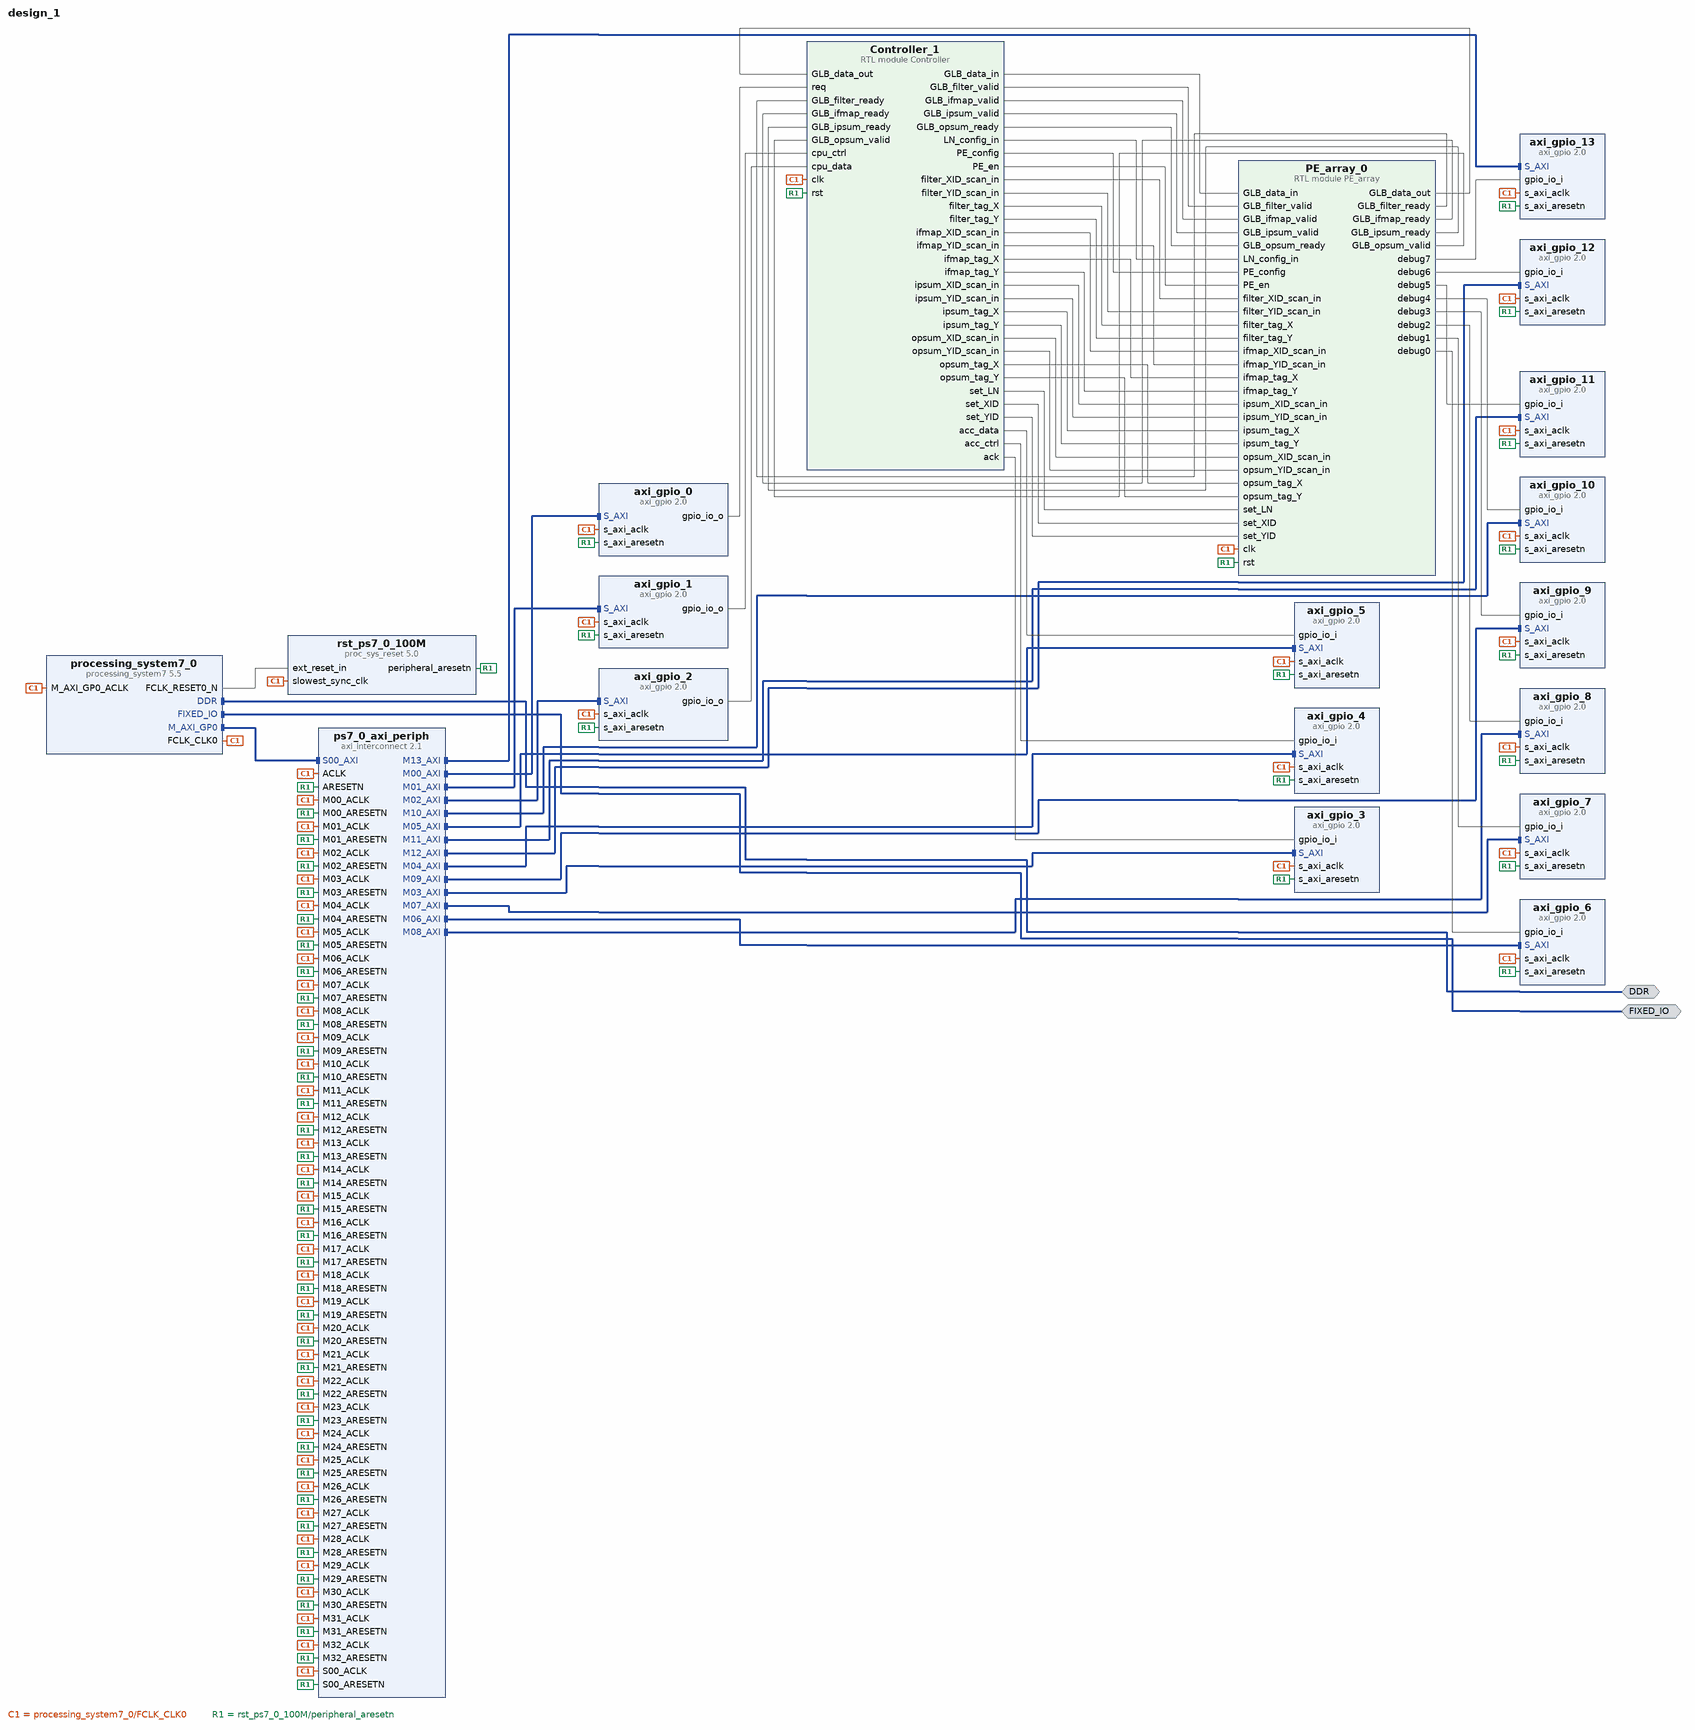
[diagram p0: block diagram of the top level]
# Vivado block design design_1, xc7z020clg400-1, Vivado 2023.2
create_bd_design design_1

create_bd_intf_port -mode Master -vlnv xilinx.com:interface:ddrx_rtl:1.0 DDR
create_bd_intf_port -mode Master -vlnv xilinx.com:display_processing_system7:fixedio_rtl:1.0 FIXED_IO

create_bd_cell -type ip -vlnv xilinx.com:ip:processing_system7:5.5 processing_system7_0
set_property -dict [list \
  CONFIG.PCW_APU_PERIPHERAL_FREQMHZ 650 \
  CONFIG.PCW_CRYSTAL_PERIPHERAL_FREQMHZ 50 \
  CONFIG.PCW_ENET0_ENET0_IO {MIO 16 .. 27} \
  CONFIG.PCW_ENET0_GRP_MDIO_ENABLE 1 \
  CONFIG.PCW_ENET0_GRP_MDIO_IO {MIO 52 .. 53} \
  CONFIG.PCW_ENET0_PERIPHERAL_ENABLE 1 \
  CONFIG.PCW_ENET0_RESET_ENABLE 1 \
  CONFIG.PCW_ENET0_RESET_IO {MIO 9} \
  CONFIG.PCW_ENET_RESET_ENABLE 1 \
  CONFIG.PCW_ENET_RESET_SELECT {Share reset pin} \
  CONFIG.PCW_FPGA0_PERIPHERAL_FREQMHZ 50 \
  CONFIG.PCW_FPGA1_PERIPHERAL_FREQMHZ 50 \
  CONFIG.PCW_GPIO_MIO_GPIO_ENABLE 1 \
  CONFIG.PCW_GPIO_MIO_GPIO_IO MIO \
  CONFIG.PCW_I2C_RESET_ENABLE 1 \
  CONFIG.PCW_M_AXI_GP0_FREQMHZ 10 \
  CONFIG.PCW_PERIPHERAL_BOARD_PRESET part0 \
  CONFIG.PCW_PRESET_BANK1_VOLTAGE {LVCMOS 1.8V} \
  CONFIG.PCW_QSPI_GRP_FBCLK_ENABLE 1 \
  CONFIG.PCW_QSPI_GRP_FBCLK_IO {MIO 8} \
  CONFIG.PCW_QSPI_GRP_SINGLE_SS_ENABLE 1 \
  CONFIG.PCW_QSPI_GRP_SINGLE_SS_IO {MIO 1 .. 6} \
  CONFIG.PCW_QSPI_PERIPHERAL_ENABLE 1 \
  CONFIG.PCW_QSPI_QSPI_IO {MIO 1 .. 6} \
  CONFIG.PCW_SD0_GRP_CD_ENABLE 1 \
  CONFIG.PCW_SD0_GRP_CD_IO {MIO 47} \
  CONFIG.PCW_SD0_GRP_WP_ENABLE 0 \
  CONFIG.PCW_SD0_PERIPHERAL_ENABLE 1 \
  CONFIG.PCW_SD0_SD0_IO {MIO 40 .. 45} \
  CONFIG.PCW_SDIO_PERIPHERAL_FREQMHZ 50 \
  CONFIG.PCW_SINGLE_QSPI_DATA_MODE x4 \
  CONFIG.PCW_UART0_PERIPHERAL_ENABLE 1 \
  CONFIG.PCW_UART0_UART0_IO {MIO 14 .. 15} \
  CONFIG.PCW_UART1_PERIPHERAL_ENABLE 0 \
  CONFIG.PCW_UART_PERIPHERAL_FREQMHZ 100 \
  CONFIG.PCW_UIPARAM_DDR_BUS_WIDTH {16 Bit} \
  CONFIG.PCW_UIPARAM_DDR_FREQ_MHZ 525 \
  CONFIG.PCW_UIPARAM_DDR_PARTNO {MT41J256M16 RE-125} \
  CONFIG.PCW_USB0_PERIPHERAL_ENABLE 1 \
  CONFIG.PCW_USB0_RESET_ENABLE 1 \
  CONFIG.PCW_USB0_RESET_IO {MIO 46} \
  CONFIG.PCW_USB0_USB0_IO {MIO 28 .. 39} \
  CONFIG.PCW_USB_RESET_ENABLE 1 \
  CONFIG.PCW_USB_RESET_SELECT {Share reset pin} \
] [get_bd_cells processing_system7_0]
# 486 more settings of processing_system7_0 are not shown: defaults, MIO pin electricals, DDR timing, and values the tool derives
create_bd_cell -type ip -vlnv xilinx.com:ip:axi_interconnect:2.1 ps7_0_axi_periph
set_property -dict {CONFIG.NUM_MI 33} [get_bd_cells ps7_0_axi_periph]
create_bd_cell -type ip -vlnv xilinx.com:ip:proc_sys_reset:5.0 rst_ps7_0_100M
create_bd_cell -type module -reference Controller Controller_1
create_bd_cell -type ip -vlnv xilinx.com:ip:axi_gpio:2.0 axi_gpio_0
set_property -dict {CONFIG.C_ALL_OUTPUTS 1 CONFIG.C_GPIO_WIDTH 8} [get_bd_cells axi_gpio_0]
create_bd_cell -type ip -vlnv xilinx.com:ip:axi_gpio:2.0 axi_gpio_1
set_property -dict {CONFIG.C_ALL_OUTPUTS 1 CONFIG.C_GPIO_WIDTH 32} [get_bd_cells axi_gpio_1]
create_bd_cell -type ip -vlnv xilinx.com:ip:axi_gpio:2.0 axi_gpio_2
set_property -dict {CONFIG.C_ALL_OUTPUTS 1 CONFIG.C_GPIO_WIDTH 32} [get_bd_cells axi_gpio_2]
create_bd_cell -type ip -vlnv xilinx.com:ip:axi_gpio:2.0 axi_gpio_3
set_property -dict {CONFIG.C_ALL_INPUTS 1} [get_bd_cells axi_gpio_3]
create_bd_cell -type ip -vlnv xilinx.com:ip:axi_gpio:2.0 axi_gpio_4
set_property -dict {CONFIG.C_ALL_INPUTS 1} [get_bd_cells axi_gpio_4]
create_bd_cell -type ip -vlnv xilinx.com:ip:axi_gpio:2.0 axi_gpio_5
set_property -dict {CONFIG.C_ALL_INPUTS 1} [get_bd_cells axi_gpio_5]
create_bd_cell -type ip -vlnv xilinx.com:ip:axi_gpio:2.0 axi_gpio_6
set_property -dict {CONFIG.C_ALL_INPUTS 1} [get_bd_cells axi_gpio_6]
create_bd_cell -type ip -vlnv xilinx.com:ip:axi_gpio:2.0 axi_gpio_7
set_property -dict {CONFIG.C_ALL_INPUTS 1} [get_bd_cells axi_gpio_7]
create_bd_cell -type ip -vlnv xilinx.com:ip:axi_gpio:2.0 axi_gpio_8
set_property -dict {CONFIG.C_ALL_INPUTS 1} [get_bd_cells axi_gpio_8]
create_bd_cell -type ip -vlnv xilinx.com:ip:axi_gpio:2.0 axi_gpio_9
set_property -dict {CONFIG.C_ALL_INPUTS 1} [get_bd_cells axi_gpio_9]
create_bd_cell -type ip -vlnv xilinx.com:ip:axi_gpio:2.0 axi_gpio_10
set_property -dict {CONFIG.C_ALL_INPUTS 1} [get_bd_cells axi_gpio_10]
create_bd_cell -type ip -vlnv xilinx.com:ip:axi_gpio:2.0 axi_gpio_11
set_property -dict {CONFIG.C_ALL_INPUTS 1} [get_bd_cells axi_gpio_11]
create_bd_cell -type ip -vlnv xilinx.com:ip:axi_gpio:2.0 axi_gpio_12
set_property -dict {CONFIG.C_ALL_INPUTS 1} [get_bd_cells axi_gpio_12]
create_bd_cell -type ip -vlnv xilinx.com:ip:axi_gpio:2.0 axi_gpio_13
set_property -dict {CONFIG.C_ALL_INPUTS 1} [get_bd_cells axi_gpio_13]
create_bd_cell -type module -reference PE_array PE_array_0

# ---- connections ----

connect_bd_intf_net [get_bd_intf_ports DDR] [get_bd_intf_pins processing_system7_0/DDR]
connect_bd_intf_net [get_bd_intf_ports FIXED_IO] [get_bd_intf_pins processing_system7_0/FIXED_IO]
connect_bd_intf_net [get_bd_intf_pins processing_system7_0/M_AXI_GP0] [get_bd_intf_pins ps7_0_axi_periph/S00_AXI]
connect_bd_intf_net [get_bd_intf_pins ps7_0_axi_periph/M00_AXI] [get_bd_intf_pins axi_gpio_0/S_AXI]
connect_bd_intf_net [get_bd_intf_pins ps7_0_axi_periph/M01_AXI] [get_bd_intf_pins axi_gpio_1/S_AXI]
connect_bd_intf_net [get_bd_intf_pins ps7_0_axi_periph/M02_AXI] [get_bd_intf_pins axi_gpio_2/S_AXI]
connect_bd_intf_net [get_bd_intf_pins ps7_0_axi_periph/M03_AXI] [get_bd_intf_pins axi_gpio_3/S_AXI]
connect_bd_intf_net [get_bd_intf_pins ps7_0_axi_periph/M04_AXI] [get_bd_intf_pins axi_gpio_4/S_AXI]
connect_bd_intf_net [get_bd_intf_pins ps7_0_axi_periph/M05_AXI] [get_bd_intf_pins axi_gpio_5/S_AXI]
connect_bd_intf_net [get_bd_intf_pins ps7_0_axi_periph/M06_AXI] [get_bd_intf_pins axi_gpio_6/S_AXI]
connect_bd_intf_net [get_bd_intf_pins ps7_0_axi_periph/M07_AXI] [get_bd_intf_pins axi_gpio_7/S_AXI]
connect_bd_intf_net [get_bd_intf_pins ps7_0_axi_periph/M08_AXI] [get_bd_intf_pins axi_gpio_8/S_AXI]
connect_bd_intf_net [get_bd_intf_pins ps7_0_axi_periph/M09_AXI] [get_bd_intf_pins axi_gpio_9/S_AXI]
connect_bd_intf_net [get_bd_intf_pins ps7_0_axi_periph/M10_AXI] [get_bd_intf_pins axi_gpio_10/S_AXI]
connect_bd_intf_net [get_bd_intf_pins ps7_0_axi_periph/M11_AXI] [get_bd_intf_pins axi_gpio_11/S_AXI]
connect_bd_intf_net [get_bd_intf_pins ps7_0_axi_periph/M12_AXI] [get_bd_intf_pins axi_gpio_12/S_AXI]
connect_bd_intf_net [get_bd_intf_pins ps7_0_axi_periph/M13_AXI] [get_bd_intf_pins axi_gpio_13/S_AXI]
connect_bd_net [get_bd_pins Controller_1/GLB_data_in] [get_bd_pins PE_array_0/GLB_data_in]
connect_bd_net [get_bd_pins Controller_1/GLB_filter_valid] [get_bd_pins PE_array_0/GLB_filter_valid]
connect_bd_net [get_bd_pins Controller_1/GLB_ifmap_valid] [get_bd_pins PE_array_0/GLB_ifmap_valid]
connect_bd_net [get_bd_pins Controller_1/GLB_ipsum_valid] [get_bd_pins PE_array_0/GLB_ipsum_valid]
connect_bd_net [get_bd_pins Controller_1/GLB_opsum_ready] [get_bd_pins PE_array_0/GLB_opsum_ready]
connect_bd_net [get_bd_pins Controller_1/LN_config_in] [get_bd_pins PE_array_0/LN_config_in]
connect_bd_net [get_bd_pins Controller_1/PE_config] [get_bd_pins PE_array_0/PE_config]
connect_bd_net [get_bd_pins Controller_1/PE_en] [get_bd_pins PE_array_0/PE_en]
connect_bd_net [get_bd_pins Controller_1/acc_ctrl] [get_bd_pins axi_gpio_4/gpio_io_i]
connect_bd_net [get_bd_pins Controller_1/acc_data] [get_bd_pins axi_gpio_5/gpio_io_i]
connect_bd_net [get_bd_pins Controller_1/ack] [get_bd_pins axi_gpio_3/gpio_io_i]
connect_bd_net [get_bd_pins Controller_1/filter_XID_scan_in] [get_bd_pins PE_array_0/filter_XID_scan_in]
connect_bd_net [get_bd_pins Controller_1/filter_YID_scan_in] [get_bd_pins PE_array_0/filter_YID_scan_in]
connect_bd_net [get_bd_pins Controller_1/filter_tag_X] [get_bd_pins PE_array_0/filter_tag_X]
connect_bd_net [get_bd_pins Controller_1/filter_tag_Y] [get_bd_pins PE_array_0/filter_tag_Y]
connect_bd_net [get_bd_pins Controller_1/ifmap_XID_scan_in] [get_bd_pins PE_array_0/ifmap_XID_scan_in]
connect_bd_net [get_bd_pins Controller_1/ifmap_YID_scan_in] [get_bd_pins PE_array_0/ifmap_YID_scan_in]
connect_bd_net [get_bd_pins Controller_1/ifmap_tag_X] [get_bd_pins PE_array_0/ifmap_tag_X]
connect_bd_net [get_bd_pins Controller_1/ifmap_tag_Y] [get_bd_pins PE_array_0/ifmap_tag_Y]
connect_bd_net [get_bd_pins Controller_1/ipsum_XID_scan_in] [get_bd_pins PE_array_0/ipsum_XID_scan_in]
connect_bd_net [get_bd_pins Controller_1/ipsum_YID_scan_in] [get_bd_pins PE_array_0/ipsum_YID_scan_in]
connect_bd_net [get_bd_pins Controller_1/ipsum_tag_X] [get_bd_pins PE_array_0/ipsum_tag_X]
connect_bd_net [get_bd_pins Controller_1/ipsum_tag_Y] [get_bd_pins PE_array_0/ipsum_tag_Y]
connect_bd_net [get_bd_pins Controller_1/opsum_XID_scan_in] [get_bd_pins PE_array_0/opsum_XID_scan_in]
connect_bd_net [get_bd_pins Controller_1/opsum_YID_scan_in] [get_bd_pins PE_array_0/opsum_YID_scan_in]
connect_bd_net [get_bd_pins Controller_1/opsum_tag_X] [get_bd_pins PE_array_0/opsum_tag_X]
connect_bd_net [get_bd_pins Controller_1/opsum_tag_Y] [get_bd_pins PE_array_0/opsum_tag_Y]
connect_bd_net [get_bd_pins Controller_1/set_LN] [get_bd_pins PE_array_0/set_LN]
connect_bd_net [get_bd_pins Controller_1/set_XID] [get_bd_pins PE_array_0/set_XID]
connect_bd_net [get_bd_pins Controller_1/set_YID] [get_bd_pins PE_array_0/set_YID]
connect_bd_net [get_bd_pins PE_array_0/GLB_data_out] [get_bd_pins Controller_1/GLB_data_out]
connect_bd_net [get_bd_pins PE_array_0/GLB_filter_ready] [get_bd_pins Controller_1/GLB_filter_ready]
connect_bd_net [get_bd_pins PE_array_0/GLB_ifmap_ready] [get_bd_pins Controller_1/GLB_ifmap_ready]
connect_bd_net [get_bd_pins PE_array_0/GLB_ipsum_ready] [get_bd_pins Controller_1/GLB_ipsum_ready]
connect_bd_net [get_bd_pins PE_array_0/GLB_opsum_valid] [get_bd_pins Controller_1/GLB_opsum_valid]
connect_bd_net [get_bd_pins PE_array_0/debug0] [get_bd_pins axi_gpio_6/gpio_io_i]
connect_bd_net [get_bd_pins PE_array_0/debug1] [get_bd_pins axi_gpio_7/gpio_io_i]
connect_bd_net [get_bd_pins PE_array_0/debug2] [get_bd_pins axi_gpio_8/gpio_io_i]
connect_bd_net [get_bd_pins PE_array_0/debug3] [get_bd_pins axi_gpio_9/gpio_io_i]
connect_bd_net [get_bd_pins PE_array_0/debug4] [get_bd_pins axi_gpio_10/gpio_io_i]
connect_bd_net [get_bd_pins PE_array_0/debug5] [get_bd_pins axi_gpio_11/gpio_io_i]
connect_bd_net [get_bd_pins PE_array_0/debug6] [get_bd_pins axi_gpio_12/gpio_io_i]
connect_bd_net [get_bd_pins PE_array_0/debug7] [get_bd_pins axi_gpio_13/gpio_io_i]
connect_bd_net [get_bd_pins axi_gpio_0/gpio_io_o] [get_bd_pins Controller_1/req]
connect_bd_net [get_bd_pins axi_gpio_1/gpio_io_o] [get_bd_pins Controller_1/cpu_ctrl]
connect_bd_net [get_bd_pins axi_gpio_2/gpio_io_o] [get_bd_pins Controller_1/cpu_data]
connect_bd_net [get_bd_pins processing_system7_0/FCLK_CLK0] \
  [get_bd_pins processing_system7_0/M_AXI_GP0_ACLK] [get_bd_pins ps7_0_axi_periph/S00_ACLK] \
  [get_bd_pins rst_ps7_0_100M/slowest_sync_clk] [get_bd_pins ps7_0_axi_periph/M00_ACLK] [get_bd_pins ps7_0_axi_periph/ACLK] \
  [get_bd_pins axi_gpio_0/s_axi_aclk] [get_bd_pins axi_gpio_1/s_axi_aclk] [get_bd_pins ps7_0_axi_periph/M01_ACLK] \
  [get_bd_pins axi_gpio_2/s_axi_aclk] [get_bd_pins ps7_0_axi_periph/M02_ACLK] [get_bd_pins axi_gpio_3/s_axi_aclk] \
  [get_bd_pins ps7_0_axi_periph/M03_ACLK] [get_bd_pins axi_gpio_4/s_axi_aclk] [get_bd_pins ps7_0_axi_periph/M04_ACLK] \
  [get_bd_pins axi_gpio_5/s_axi_aclk] [get_bd_pins ps7_0_axi_periph/M05_ACLK] [get_bd_pins axi_gpio_6/s_axi_aclk] \
  [get_bd_pins ps7_0_axi_periph/M06_ACLK] [get_bd_pins axi_gpio_7/s_axi_aclk] [get_bd_pins ps7_0_axi_periph/M07_ACLK] \
  [get_bd_pins axi_gpio_8/s_axi_aclk] [get_bd_pins ps7_0_axi_periph/M08_ACLK] [get_bd_pins axi_gpio_9/s_axi_aclk] \
  [get_bd_pins ps7_0_axi_periph/M09_ACLK] [get_bd_pins axi_gpio_10/s_axi_aclk] [get_bd_pins ps7_0_axi_periph/M10_ACLK] \
  [get_bd_pins axi_gpio_11/s_axi_aclk] [get_bd_pins ps7_0_axi_periph/M11_ACLK] [get_bd_pins axi_gpio_12/s_axi_aclk] \
  [get_bd_pins ps7_0_axi_periph/M12_ACLK] [get_bd_pins axi_gpio_13/s_axi_aclk] [get_bd_pins ps7_0_axi_periph/M13_ACLK] \
  [get_bd_pins ps7_0_axi_periph/M14_ACLK] [get_bd_pins ps7_0_axi_periph/M15_ACLK] [get_bd_pins ps7_0_axi_periph/M16_ACLK] \
  [get_bd_pins ps7_0_axi_periph/M17_ACLK] [get_bd_pins ps7_0_axi_periph/M18_ACLK] [get_bd_pins ps7_0_axi_periph/M19_ACLK] \
  [get_bd_pins ps7_0_axi_periph/M20_ACLK] [get_bd_pins ps7_0_axi_periph/M21_ACLK] [get_bd_pins ps7_0_axi_periph/M22_ACLK] \
  [get_bd_pins ps7_0_axi_periph/M23_ACLK] [get_bd_pins ps7_0_axi_periph/M24_ACLK] [get_bd_pins ps7_0_axi_periph/M25_ACLK] \
  [get_bd_pins ps7_0_axi_periph/M26_ACLK] [get_bd_pins ps7_0_axi_periph/M27_ACLK] [get_bd_pins ps7_0_axi_periph/M28_ACLK] \
  [get_bd_pins ps7_0_axi_periph/M29_ACLK] [get_bd_pins ps7_0_axi_periph/M30_ACLK] [get_bd_pins ps7_0_axi_periph/M31_ACLK] \
  [get_bd_pins ps7_0_axi_periph/M32_ACLK] [get_bd_pins PE_array_0/clk] [get_bd_pins Controller_1/clk]
connect_bd_net [get_bd_pins processing_system7_0/FCLK_RESET0_N] [get_bd_pins rst_ps7_0_100M/ext_reset_in]
connect_bd_net [get_bd_pins rst_ps7_0_100M/peripheral_aresetn] \
  [get_bd_pins ps7_0_axi_periph/S00_ARESETN] [get_bd_pins ps7_0_axi_periph/M00_ARESETN] \
  [get_bd_pins ps7_0_axi_periph/ARESETN] [get_bd_pins axi_gpio_0/s_axi_aresetn] [get_bd_pins axi_gpio_1/s_axi_aresetn] \
  [get_bd_pins ps7_0_axi_periph/M01_ARESETN] [get_bd_pins axi_gpio_2/s_axi_aresetn] \
  [get_bd_pins ps7_0_axi_periph/M02_ARESETN] [get_bd_pins axi_gpio_3/s_axi_aresetn] \
  [get_bd_pins ps7_0_axi_periph/M03_ARESETN] [get_bd_pins axi_gpio_4/s_axi_aresetn] \
  [get_bd_pins ps7_0_axi_periph/M04_ARESETN] [get_bd_pins axi_gpio_5/s_axi_aresetn] \
  [get_bd_pins ps7_0_axi_periph/M05_ARESETN] [get_bd_pins axi_gpio_6/s_axi_aresetn] \
  [get_bd_pins ps7_0_axi_periph/M06_ARESETN] [get_bd_pins axi_gpio_7/s_axi_aresetn] \
  [get_bd_pins ps7_0_axi_periph/M07_ARESETN] [get_bd_pins axi_gpio_8/s_axi_aresetn] \
  [get_bd_pins ps7_0_axi_periph/M08_ARESETN] [get_bd_pins axi_gpio_9/s_axi_aresetn] \
  [get_bd_pins ps7_0_axi_periph/M09_ARESETN] [get_bd_pins axi_gpio_10/s_axi_aresetn] \
  [get_bd_pins ps7_0_axi_periph/M10_ARESETN] [get_bd_pins axi_gpio_11/s_axi_aresetn] \
  [get_bd_pins ps7_0_axi_periph/M11_ARESETN] [get_bd_pins axi_gpio_12/s_axi_aresetn] \
  [get_bd_pins ps7_0_axi_periph/M12_ARESETN] [get_bd_pins axi_gpio_13/s_axi_aresetn] \
  [get_bd_pins ps7_0_axi_periph/M13_ARESETN] [get_bd_pins ps7_0_axi_periph/M14_ARESETN] \
  [get_bd_pins ps7_0_axi_periph/M15_ARESETN] [get_bd_pins ps7_0_axi_periph/M16_ARESETN] \
  [get_bd_pins ps7_0_axi_periph/M17_ARESETN] [get_bd_pins ps7_0_axi_periph/M18_ARESETN] \
  [get_bd_pins ps7_0_axi_periph/M19_ARESETN] [get_bd_pins ps7_0_axi_periph/M20_ARESETN] \
  [get_bd_pins ps7_0_axi_periph/M21_ARESETN] [get_bd_pins ps7_0_axi_periph/M22_ARESETN] \
  [get_bd_pins ps7_0_axi_periph/M23_ARESETN] [get_bd_pins ps7_0_axi_periph/M24_ARESETN] \
  [get_bd_pins ps7_0_axi_periph/M25_ARESETN] [get_bd_pins ps7_0_axi_periph/M26_ARESETN] \
  [get_bd_pins ps7_0_axi_periph/M27_ARESETN] [get_bd_pins ps7_0_axi_periph/M28_ARESETN] \
  [get_bd_pins ps7_0_axi_periph/M29_ARESETN] [get_bd_pins ps7_0_axi_periph/M30_ARESETN] \
  [get_bd_pins ps7_0_axi_periph/M31_ARESETN] [get_bd_pins ps7_0_axi_periph/M32_ARESETN] [get_bd_pins PE_array_0/rst] \
  [get_bd_pins Controller_1/rst]

# ---- address map ----
assign_bd_address -offset 0x41200000 -range 64K -target_address_space [get_bd_addr_spaces processing_system7_0/Data] [get_bd_addr_segs axi_gpio_0/S_AXI/Reg]
assign_bd_address -offset 0x41210000 -range 64K -target_address_space [get_bd_addr_spaces processing_system7_0/Data] [get_bd_addr_segs axi_gpio_1/S_AXI/Reg]
assign_bd_address -offset 0x41220000 -range 64K -target_address_space [get_bd_addr_spaces processing_system7_0/Data] [get_bd_addr_segs axi_gpio_2/S_AXI/Reg]
assign_bd_address -offset 0x41230000 -range 64K -target_address_space [get_bd_addr_spaces processing_system7_0/Data] [get_bd_addr_segs axi_gpio_3/S_AXI/Reg]
assign_bd_address -offset 0x41240000 -range 64K -target_address_space [get_bd_addr_spaces processing_system7_0/Data] [get_bd_addr_segs axi_gpio_4/S_AXI/Reg]
assign_bd_address -offset 0x41250000 -range 64K -target_address_space [get_bd_addr_spaces processing_system7_0/Data] [get_bd_addr_segs axi_gpio_5/S_AXI/Reg]
assign_bd_address -offset 0x41260000 -range 64K -target_address_space [get_bd_addr_spaces processing_system7_0/Data] [get_bd_addr_segs axi_gpio_6/S_AXI/Reg]
assign_bd_address -offset 0x41270000 -range 64K -target_address_space [get_bd_addr_spaces processing_system7_0/Data] [get_bd_addr_segs axi_gpio_7/S_AXI/Reg]
assign_bd_address -offset 0x41280000 -range 64K -target_address_space [get_bd_addr_spaces processing_system7_0/Data] [get_bd_addr_segs axi_gpio_8/S_AXI/Reg]
assign_bd_address -offset 0x41290000 -range 64K -target_address_space [get_bd_addr_spaces processing_system7_0/Data] [get_bd_addr_segs axi_gpio_9/S_AXI/Reg]
assign_bd_address -offset 0x412A0000 -range 64K -target_address_space [get_bd_addr_spaces processing_system7_0/Data] [get_bd_addr_segs axi_gpio_10/S_AXI/Reg]
assign_bd_address -offset 0x412B0000 -range 64K -target_address_space [get_bd_addr_spaces processing_system7_0/Data] [get_bd_addr_segs axi_gpio_11/S_AXI/Reg]
assign_bd_address -offset 0x412C0000 -range 64K -target_address_space [get_bd_addr_spaces processing_system7_0/Data] [get_bd_addr_segs axi_gpio_12/S_AXI/Reg]
assign_bd_address -offset 0x412D0000 -range 64K -target_address_space [get_bd_addr_spaces processing_system7_0/Data] [get_bd_addr_segs axi_gpio_13/S_AXI/Reg]

validate_bd_design
save_bd_design
